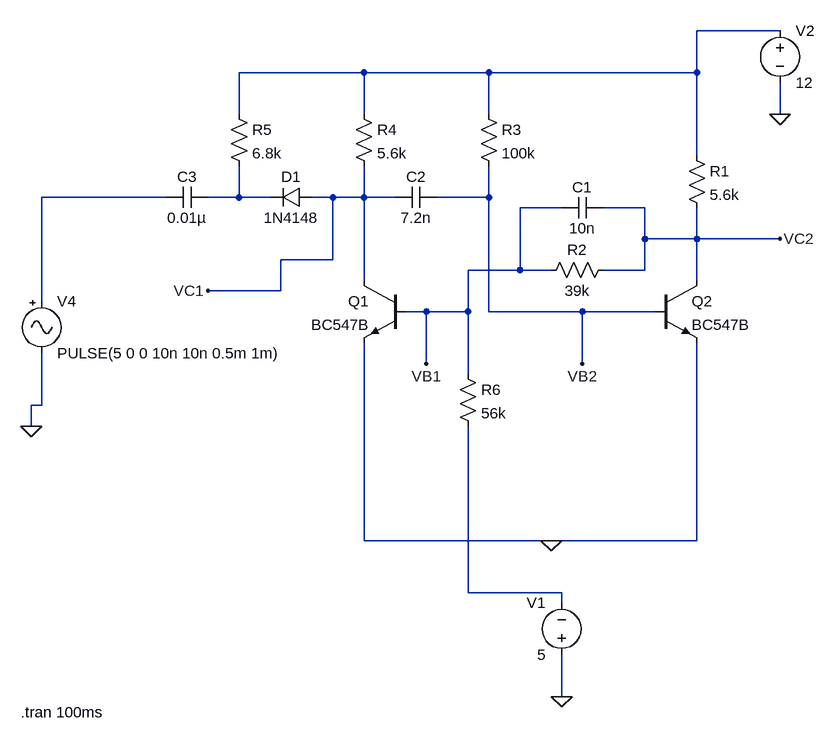
[diagram p0: schematic ms.asc]
ms.asc, the LTspice schematic file:
Version 4
SHEET 1 880 840
WIRE 576 -224 448 -224
WIRE -64 -160 -256 -160
WIRE 128 -160 -64 -160
WIRE 448 -160 448 -224
WIRE 448 -160 128 -160
WIRE -256 -96 -256 -160
WIRE -64 -96 -64 -160
WIRE 128 -96 128 -160
WIRE 576 -96 576 -144
WIRE 448 -32 448 -160
WIRE -368 32 -560 32
WIRE -256 32 -256 -16
WIRE -256 32 -304 32
WIRE -208 32 -256 32
WIRE -112 32 -144 32
WIRE -64 32 -64 -16
WIRE -64 32 -112 32
WIRE -16 32 -64 32
WIRE 128 32 128 -16
WIRE 128 32 48 32
WIRE 240 48 176 48
WIRE 368 48 304 48
WIRE 368 96 368 48
WIRE 448 96 448 48
WIRE 448 96 368 96
WIRE 576 96 448 96
WIRE -112 128 -112 32
WIRE -112 128 -192 128
WIRE 176 144 176 48
WIRE 176 144 96 144
WIRE 224 144 176 144
WIRE 368 144 368 96
WIRE 368 144 304 144
WIRE -64 160 -64 32
WIRE 448 160 448 96
WIRE -192 176 -192 128
WIRE -192 176 -304 176
WIRE -560 192 -560 32
WIRE 32 208 0 208
WIRE 96 208 96 144
WIRE 96 208 32 208
WIRE 128 208 128 32
WIRE 272 208 128 208
WIRE 384 208 272 208
WIRE 32 288 32 208
WIRE 272 288 272 208
WIRE 96 304 96 208
WIRE -560 352 -560 272
WIRE -560 352 -576 352
WIRE -576 384 -576 352
WIRE -64 560 -64 256
WIRE 224 560 -64 560
WIRE 448 560 448 256
WIRE 448 560 224 560
WIRE 96 640 96 384
WIRE 240 640 96 640
WIRE 240 656 240 640
WIRE 240 800 240 736
FLAG 240 800 0
FLAG 576 -96 0
FLAG 576 96 VC2
FLAG 272 288 VB2
FLAG 32 288 VB1
FLAG -304 176 VC1
FLAG -576 384 0
FLAG 224 560 0
SYMBOL npn 384 160 R0
SYMATTR InstName Q2
SYMATTR Value BC547B
SYMBOL npn 0 160 M0
SYMATTR InstName Q1
SYMATTR Value BC547B
SYMBOL res 432 -48 R0
SYMATTR InstName R1
SYMATTR Value 5.6k
SYMBOL cap 304 32 R90
WINDOW 0 0 32 VBottom 2
WINDOW 3 32 32 VTop 2
SYMATTR InstName C1
SYMATTR Value 10n
SYMBOL res 320 128 R90
WINDOW 0 0 56 VBottom 2
WINDOW 3 32 56 VTop 2
SYMATTR InstName R2
SYMATTR Value 39k
SYMBOL cap 48 16 R90
WINDOW 0 0 32 VBottom 2
WINDOW 3 32 32 VTop 2
SYMATTR InstName C2
SYMATTR Value 7.2n
SYMBOL res 112 -112 R0
SYMATTR InstName R3
SYMATTR Value 100k
SYMBOL res -80 -112 R0
SYMATTR InstName R4
SYMATTR Value 5.6k
SYMBOL diode -144 16 R90
WINDOW 0 0 32 VBottom 2
WINDOW 3 32 32 VTop 2
SYMATTR InstName D1
SYMATTR Value 1N4148
SYMBOL cap -304 16 R90
WINDOW 0 0 32 VBottom 2
WINDOW 3 32 32 VTop 2
SYMATTR InstName C3
SYMATTR Value 0.01µ
SYMBOL res -272 -112 R0
SYMATTR InstName R5
SYMATTR Value 6.8k
SYMBOL res 80 288 R0
SYMATTR InstName R6
SYMATTR Value 56k
SYMBOL voltage 240 752 R180
WINDOW 0 24 96 Left 2
WINDOW 3 24 16 Left 2
WINDOW 123 0 0 Left 0
WINDOW 39 0 0 Left 0
SYMATTR InstName V1
SYMATTR Value 5
SYMBOL voltage 576 -240 R0
WINDOW 123 0 0 Left 0
WINDOW 39 0 0 Left 0
SYMATTR InstName V2
SYMATTR Value 12
SYMBOL Misc\\signal -560 176 R0
WINDOW 123 0 0 Left 0
WINDOW 39 0 0 Left 0
SYMATTR InstName V4
SYMATTR Value PULSE(5 0 0 10n 10n 0.5m 1m)
TEXT -592 824 Left 2 !.tran 100ms

The netlist it stands for:
* ms.asc
Q2 VC2 VB2 0 0 BC547B
Q1 VC1 VB1 0 0 BC547B
R1 N001 VC2 5.6k
C1 VC2 VB1 10n
R2 VC2 VB1 39k
C2 VB2 VC1 7.2n
R3 N001 VB2 100k
R4 N001 VC1 5.6k
D1 VC1 N003 1N4148
C3 N003 N002 0.01µ
R5 N001 N003 6.8k
R6 VB1 N004 56k
V1 0 N004 5
V2 N001 0 12
V4 N002 0 PULSE(5 0 0 10n 10n 0.5m 1m)
.model D D
.lib standard.dio
.model NPN NPN
.model PNP PNP
.lib standard.bjt
.tran 100ms
.backanno
.end